# Altium schematic sheet OpenPack_BATMOD_V1p0_MCU.SchDoc
size A4; SheetNumber: 9; SheetTotal: 10; Title_: Microcontroller
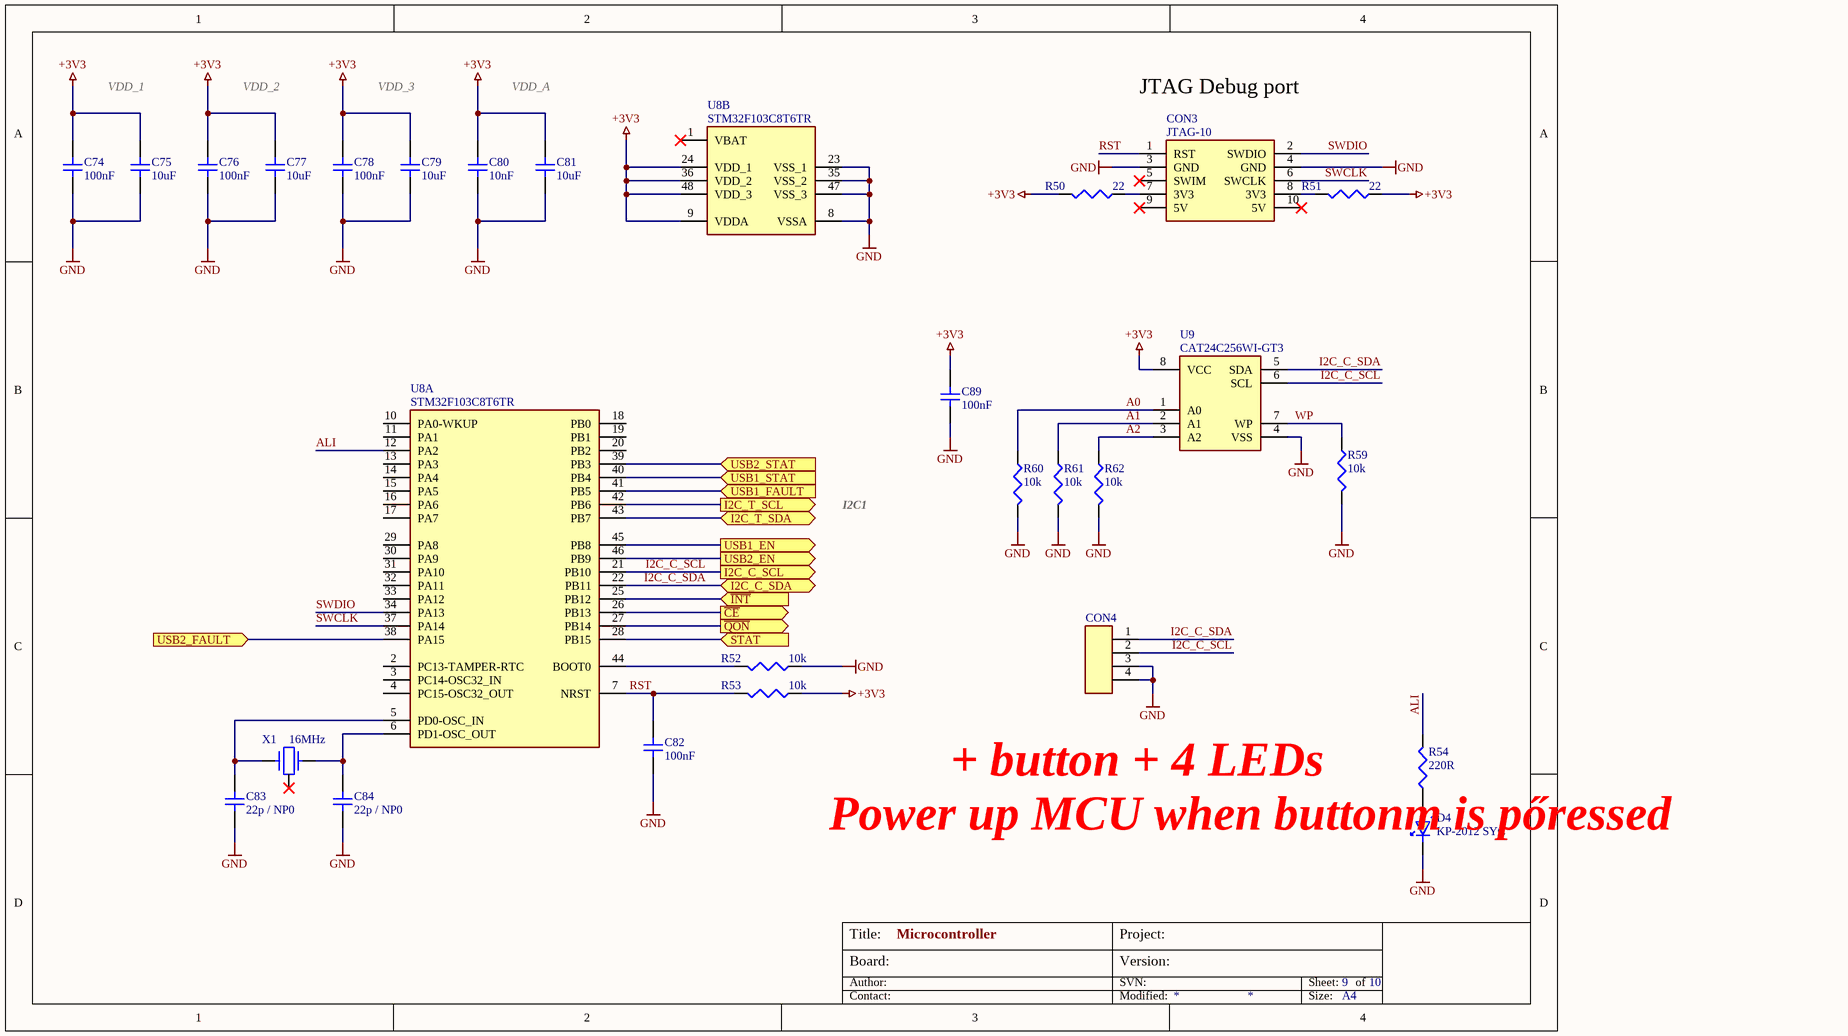
[diagram p0: OpenPack_BATMOD_V1p0_MCU.SchDoc]

## Parts
C74  100nF  [CAP_0603]
C75  10uF  [CAP_0603]
C76  100nF  [CAP_0603]
C77  10uF  [CAP_0603]
C78  100nF  [CAP_0603]
C79  10uF  [CAP_0603]
C80  10nF  [CAP_0603]
C81  10uF  [CAP_0603]
C82  100nF  [CAP_0603]
C83  22p / NP0  [CAP_0603]
C84  22p / NP0  [CAP_0603]
C89  100nF  [CAP_0603]
CON3  JTAG-10  [CON10-2x5]
CON4  CON4  [CON4_SIMPLE_TH]  (value not drawn)
D4  KP-2012 SYC  [KP-2012-GRN]
R50  22  [RES-0603]
R51  22  [RES-0603]
R52  10k  [RES-0603]
R53  10k  [RES-0603]
R54  220R  [RES-0603]
R59  10k  [RES-0603]
R60  10k  [RES-0603]
R61  10k  [RES-0603]
R62  10k  [RES-0603]
U8  STM32F103C8T6TR  [LQFP48_L]  (parts A,B of 2)
U9  CAT24C256WI-GT3  [SOIC8]
X1  16MHz  [XTAL-32x25]

## Ports
I2C_C_SCL (out, see OpenPack_BATMOD_V1p0_MAIN, OpenPack_BATMOD_V1p0_MAN), I2C_C_SDA (bidir, see OpenPack_BATMOD_V1p0_MAIN, OpenPack_BATMOD_V1p0_MAN), I2C_T_SCL (out, see OpenPack_BATMOD_V1p0_MAIN, OpenPack_BATMOD_V1p0_MAN), I2C_T_SDA (bidir, see OpenPack_BATMOD_V1p0_MAIN, OpenPack_BATMOD_V1p0_MAN), STAT (in, see OpenPack_BATMOD_V1p0_MAIN, OpenPack_BATMOD_V1p0_CHRG), USB1_EN (out, see OpenPack_BATMOD_V1p0_MAIN), USB1_FAULT (in, see OpenPack_BATMOD_V1p0_MAIN), USB1_STAT (in, see OpenPack_BATMOD_V1p0_MAIN), USB2_EN (out, see OpenPack_BATMOD_V1p0_MAIN), USB2_FAULT (in, see OpenPack_BATMOD_V1p0_MAIN), USB2_STAT (in, see OpenPack_BATMOD_V1p0_MAIN), ~{CE} (out, see OpenPack_BATMOD_V1p0_MAIN, OpenPack_BATMOD_V1p0_CHRG), ~{INT} (in, see OpenPack_BATMOD_V1p0_MAIN, OpenPack_BATMOD_V1p0_CHRG), ~{QON} (out, see OpenPack_BATMOD_V1p0_MAIN, OpenPack_BATMOD_V1p0_CHRG)

## Nets
+3V3: C74.2 C75.2 C76.2 C77.2 C78.2 C79.2 C80.2 C81.2 C89.2 R50.1 R51.2 R53.2 U8.9(VDDA) U8.24(VDD_1) U8.36(VDD_2) U8.48(VDD_3) U9.8(VCC)
GND: C74.1 C75.1 C76.1 C77.1 C78.1 C79.1 C80.1 C81.1 C82.1 C83.1 C84.1 C89.1 CON3.3(GND) CON3.4(GND) CON4.3 CON4.4 D4.2 R52.2 R59.1 R60.1 R61.1 R62.1 U8.8(VSSA) U8.23(VSS_1) U8.35(VSS_2) U8.47(VSS_3) U9.4(VSS)
A0: R60.2 U9.1(A0)
A1: R61.2 U9.2(A1)
A2: R62.2 U9.3(A2)
ALI: R54.1 U8.12(PA2)
~{CE}: U8.26(PB13) ; port ~{CE}
I2C_C_SCL: CON4.2 U8.21(PB10) U9.6(SCL) ; port I2C_C_SCL
I2C_C_SDA: CON4.1 U8.22(PB11) U9.5(SDA) ; port I2C_C_SDA
I2C_T_SCL: U8.42(PB6) ; port I2C_T_SCL
I2C_T_SDA: U8.43(PB7) ; port I2C_T_SDA
~{INT}: U8.25(PB12) ; port ~{INT}
~{QON}: U8.27(PB14) ; port ~{QON}
RST: C82.2 CON3.1(RST) R53.1 U8.7(NRST)
STAT: U8.28(PB15) ; port STAT
SWCLK: CON3.6(SWCLK) U8.37(PA14)
SWDIO: CON3.2(SWDIO) U8.34(PA13)
USB1_EN: U8.45(PB8) ; port USB1_EN
USB1_FAULT: U8.41(PB5) ; port USB1_FAULT
USB1_STAT: U8.40(PB4) ; port USB1_STAT
USB2_EN: U8.46(PB9) ; port USB2_EN
USB2_FAULT: U8.38(PA15) ; port USB2_FAULT
USB2_STAT: U8.39(PB3) ; port USB2_STAT
WP: R59.2 U9.7(WP)
NetC83_2: C83.2 U8.5(PD0-OSC_IN) X1.1
NetC84_2: C84.2 U8.6(PD1-OSC_OUT) X1.3
NetCON3_7: CON3.7(3V3) R50.2
NetCON3_8: CON3.8(3V3) R51.1
NetD4_1: D4.1 R54.2
NetR52_1: R52.1 U8.44(BOOT0)
NetX1_2: X1.2 X1.4

Not connected (* = marked no-connect by the designer): CON3 5(SWIM)* 9(5V)* 10(5V)*; U8 1(VBAT)* 2(PC13-TAMPER-RTC) 3(PC14-OSC32_IN) 4(PC15-OSC32_OUT) 10(PA0-WKUP) 11(PA1) 13(PA3) 14(PA4) 15(PA5) 16(PA6) 17(PA7) 18(PB0) 19(PB1) 20(PB2) 29(PA8) 30(PA9) 31(PA10) 32(PA11) 33(PA12)

## Notes on the sheet
- VDD_1
- VDD_2
- VDD_3
- VDD_A
- JTAG Debug port
- I2C1
- + button + 4 LEDs
- Power up MCU when buttonm is pőressed
- Board:
- Author:
- Title:
- Project:
- SVN:
- Version:
- Sheet:
- of
- Contact:
- Modified:
- Size:
- A4

## Library data of the parts
C74-C84 C89 = NP-CAPACITOR: MLCC capacitor; Type: CAP
CON3 = JTAG: JTAG programing connector, 10pin; Part number: 100.261.60; Type: CON; Supplier: Hestore; ComponentLink1Description: Datasheet; ComponentLink1URL: ZL231-10PG_EN_10026160.pdf; ComponentLink2Description: Order; ComponentLink2URL: https://www.hestore.hu/prod_10026160.html
CON4 = CON4: Simple 4pin THT, 2.54mm
D4 = KP-2012 SYC: Yellow LED; Part number: 100.290.81; Type: Diode; ComponentLink1Description: Datasheet; ComponentLink1URL: KP-2012SYC_EN_10029081.pdf; Supplier: Hestore; ComponentLink2Description: Order; ComponentLink2URL: https://www.hestore.hu/prod_10029081.html
R50-R54 R59-R62 = RESISTOR: Metal Film Resistor; Type: RES
U8 = STM32F103C8T6TR: ARM MCU, Cortex-M3, 32 bit, 72 MHz, 64 KB; Part number: 3129604; Supplier: Farnell; ComponentLink1Description: Datasheet; ComponentLink1URL: SGST-S-A0001117293-1.pdf; ComponentLink2Description: Order; ComponentLink2URL: https://hu.farnell.com/stmicroelectronics/stm32f103c8t6tr/mcu-32bit-72mhz-lqfp-48/dp/3129604?st=stm32f103c8t6tr; Type: IC
U9 = CAT24C256WI-GT3: EEPROM 256kb I2C; Part number: 698-CAT24C256WI-GT3; ComponentLink1Description: Datasheet; Supplier: Mouser; ComponentLink2Description: Order; ComponentLink2URL: https://hu.mouser.com/en/ProductDetail/onsemi/CAT24C256WI-GT3?qs=rZgeL6XvLwaEqwp5Dppodg%3D%3D; Type: IC
X1 = 16M-SMD3225: Crystal oscillator, 16MHz, ±10ppm; Part number: 100.387.05; Type: OTHER; Supplier: Hestore; ComponentLink1Description: Datasheet; ComponentLink1URL: 3225-12M-SR_EN_10044508.pdf; ComponentLink2Description: Order; ComponentLink2URL: https://www.hestore.hu/prod_10038705.html